# Altium project JlinkV9_RST.PrjPcb
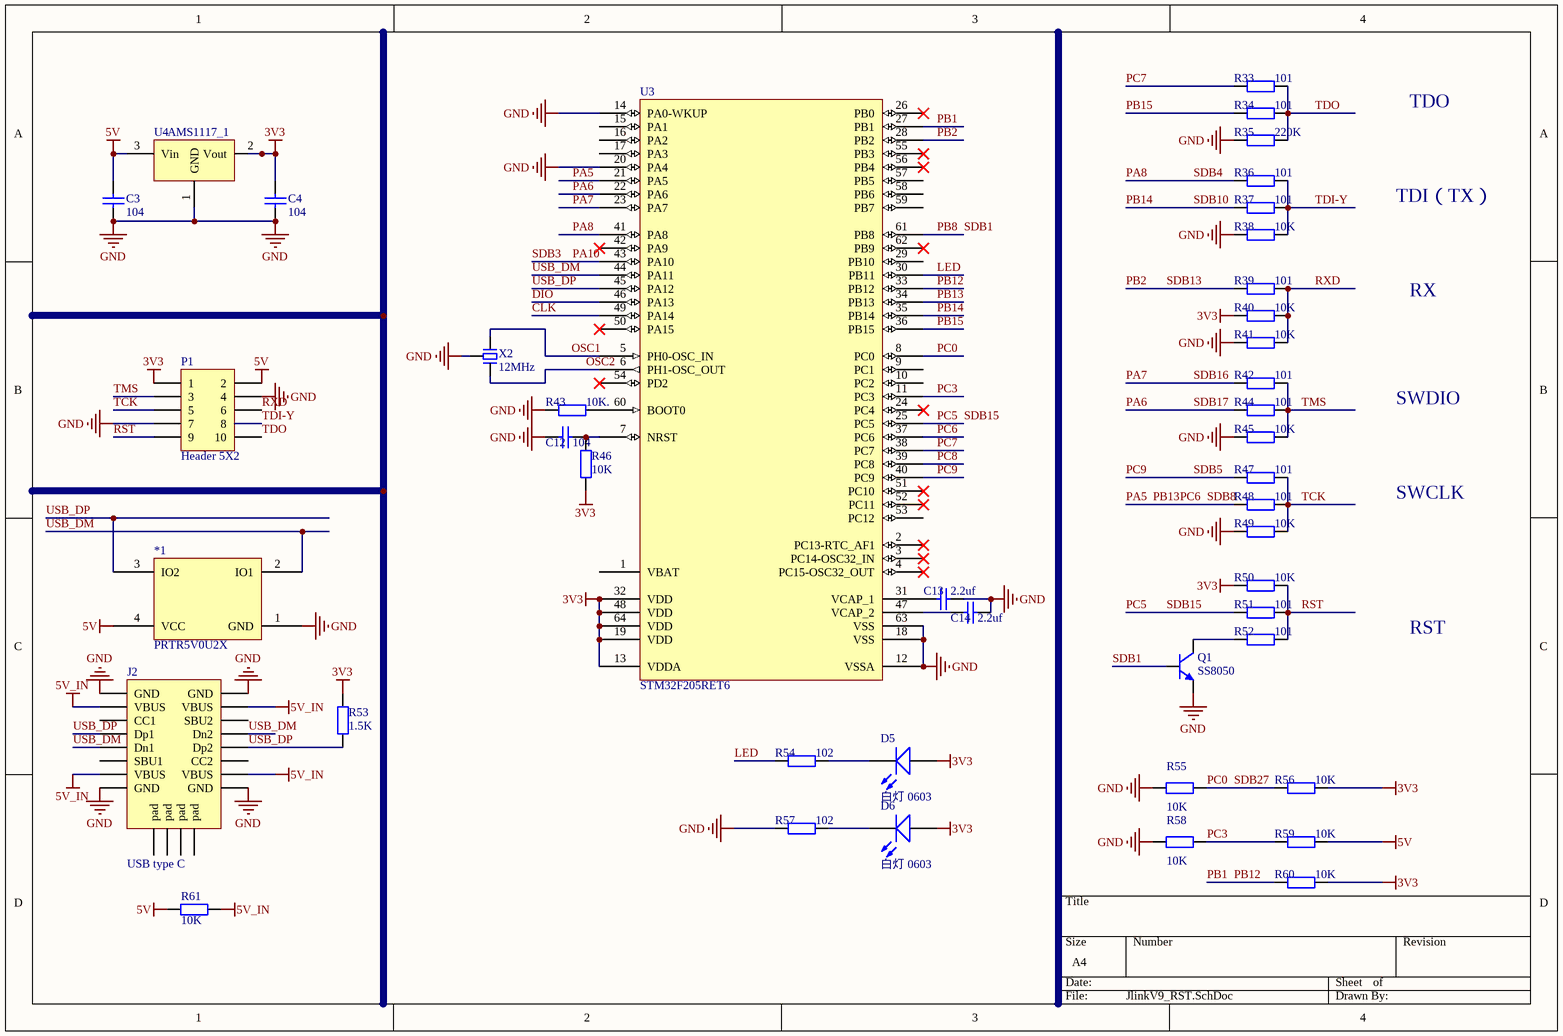
[diagram p0: JlinkV9_RST.SchDoc]
1 sheet, 43 parts. Net scope: global (net labels, ports and power ports of the same name join across sheets).
Board file: JlinkV9_RST.PcbDoc

## Sheet JlinkV9_RST.SchDoc
size A4

### Parts
*1  PRTR5V0U2X  [LC-SOT-143]
C3  104  [LC-0603_C]
C4  104  [LC-0603_C]
C12  104  [LC-0603_C]
C13  2.2UF  [LC-0603_C]
C14  2.2UF  [LC-0603_C]
D5  白灯 0603  [0603_LED_S1]
D6  白灯 0603  [0603_LED_S1]
J2  USB type C  [USB Type-C-16Pin_A]
P1  Header 5X2  [300S-2*5P 2.54MM_2]
Q1  SS8050  [SOT23-3N]
R33  value 101  [LC-0603_R]  (hidden comment: 100R)
R34  value 101  [LC-0603_R]  (hidden comment: 100R)
R35  value 220K  [LC-0603_R]  (hidden comment: 10K)
R36  value 101  [LC-0603_R]  (hidden comment: 100R)
R37  value 101  [LC-0603_R]  (hidden comment: 100R)
R38  10K  [LC-0603_R]
R39  value 101  [LC-0603_R]  (hidden comment: 100R)
R40  10K  [LC-0603_R]
R41  value 10K  [LC-0603_R]  (hidden comment: NC)
R42  value 101  [LC-0603_R]  (hidden comment: 100R)
R43  value 10K.  [LC-0603_R]  (hidden comment: 10K)
R44  value 101  [LC-0603_R]  (hidden comment: 100R)
R45  10K  [LC-0603_R]
R46  10K  [LC-0603_R]
R47  value 101  [LC-0603_R]  (hidden comment: 100R)
R48  value 101  [LC-0603_R]  (hidden comment: 100R)
R49  10K  [LC-0603_R]
R50  value 10K  [LC-0603_R]  (hidden comment: 100R)
R51  value 101  [LC-0603_R]  (hidden comment: 100R)
R52  value 101  [LC-0603_R]  (hidden comment: 100R)
R53  value 1.5K  [LC-0603_R]  (hidden comment: 1K)
R54  value 102  [LC-0603_R]  (hidden comment: 1K)
R55  10K  [LC-0603_R]
R56  10K  [LC-0603_R]
R57  value 102  [LC-0603_R]  (hidden comment: 1K)
R58  10K  [LC-0603_R]
R59  10K  [LC-0603_R]
R60  10K  [LC-0603_R]
R61  value 10K  [LC-0805_R]  (hidden comment: 1A保险丝)
U3  STM32F205RET6  [LQFP64 10x10_N]
U4  AMS1117_1  [LC-SOT-223]
X2  12MHz  [3脚晶振]

### Nets
3V3: C4.2 D5.A D6.A P1.1 R40.1 R46.1 R50.1 R53.1 R56.2 R60.2 U3.13(VDDA) U3.19(VDD) U3.32(VDD) U3.48(VDD) U3.64(VDD) U4.2(Vout)
5V: *1.4(VCC) C3.2 P1.2 R59.2 R61.1 U4.3(Vin)
5V_IN: J2.A4(VBUS) J2.A9(VBUS) J2.B4(VBUS) J2.B9(VBUS) R61.2
GND: *1.1(GND) C3.1 C4.1 C12.2 C13.1 C14.1 J2.A1(GND) J2.A12(GND) J2.B1(GND) J2.B12(GND) P1.4 P1.7 Q1.2(E) R35.1 R38.1 R41.1 R43.1 R45.1 R49.1 R55.1 R57.1 R58.1 U3.12(VSSA) U3.14(PA0-WKUP) U3.18(VSS) U3.20(PA4) U3.63(VSS) U4.1(GND) X2.3
CLK: U3.49(PA14)
DIO: U3.46(PA13)
LED: R54.1 U3.30(PB11)
OSC1: U3.5(PH0-OSC_IN) X2.1
OSC2: U3.6(PH1-OSC_OUT) X2.2
PA5: R48.1 U3.21(PA5) U3.34(PB13) U3.37(PC6)  [also labelled PB13, PC6, SDB8]
PA6: R44.1 U3.22(PA6)  [also labelled SDB17]
PA7: R42.1 U3.23(PA7)  [also labelled SDB16]
PA8: R36.1 U3.41(PA8)  [also labelled SDB4]
PA10: U3.43(PA10)  [also labelled SDB3]
PB1: R60.1 U3.27(PB1) U3.33(PB12)  [also labelled PB12]
PB2: R39.1 U3.28(PB2)  [also labelled SDB13]
PB8: Q1.1(B) U3.61(PB8)  [also labelled SDB1]
PB14: R37.1 U3.35(PB14)  [also labelled SDB10]
PB15: R34.1 U3.36(PB15)
PC0: R55.2 R56.1 U3.8(PC0)  [also labelled SDB27]
PC3: R58.2 R59.1 U3.11(PC3)
PC5: R51.1 U3.25(PC5)  [also labelled SDB15]
PC7: R33.1 U3.38(PC7)
PC8: U3.39(PC8)
PC9: R47.1 U3.40(PC9)  [also labelled SDB5]
RST: P1.9 R50.2 R51.2 R52.2
RXD: P1.6 R39.2 R40.2 R41.2
TCK: P1.5 R47.2 R48.2 R49.2
TDI-Y: P1.8 R36.2 R37.2 R38.2
TDO: P1.10 R33.2 R34.2 R35.2
TMS: P1.3 R42.2 R44.2 R45.2
USB_DM: *1.2(IO1) J2.A7(Dn1) J2.B7(Dn2) U3.44(PA11)
USB_DP: *1.3(IO2) J2.A6(Dp1) J2.B6(Dp2) R53.2 U3.45(PA12)
NetC12_1: C12.1 R46.2 U3.7(NRST)
NetC13_2: C13.2 U3.31(VCAP_1)
NetC14_2: C14.2 U3.47(VCAP_2)
NetD5_K: D5.K R54.2
NetD6_K: D6.K R57.2
NetQ1_3: Q1.3(C) R52.1
NetR43_2: R43.2 U3.60(BOOT0)

Not connected (* = marked no-connect by the designer): J2 0(pad) A5(CC1) A8(SBU1) B5(CC2) B8(SBU2); U3 1(VBAT) 2(PC13-RTC_AF1)* 3(PC14-OSC32_IN)* 4(PC15-OSC32_OUT)* 9(PC1) 10(PC2) 15(PA1) 16(PA2) 17(PA3) 24(PC4)* 26(PB0)* 29(PB10) 42(PA9)* 50(PA15)* 51(PC10)* 52(PC11)* 53(PC12) 54(PD2)* 55(PB3)* 56(PB4)* 57(PB5) 58(PB6) 59(PB7) 62(PB9)*

### Notes on the sheet
- TDO
- TDI（TX）
- RX
- SWDIO
- SWCLK
- RST

### Library data of the parts
C3 C4 C12-C14 = Cap: Polarized Capacitor (Radial); Published: 8-Jun-2000; Revision: July-2002: Re-released for DXP Platform.; Publisher: Altium Limited
  C3 C4 C12: Value: 104
  C13 C14: Value: 2.2uf
D5 D6 = 0603 白灯: 发光二极管; ComponentLink1Description: 供应商链接; ComponentLink1URL: http://www.szlcsc.com/product/details_2663.html; Package: 0603; Supplier: LC; SuppliersPartNumber: C2290
J2 = USB_C
P1 = Header 5X2: Header, 5-Pin, Dual row; LatestRevisionDate: 17-Jul-2002; LatestRevisionNote: Re-released for DXP Platform.; Publisher: Altium Limited
Q1 = 8050-SMD: 高频放大-NPN型; 版权归属: 源创客; 属性: 40V 1.5A 1W 100MHZ; BOM名称: 高频放大-NPN型; 学习资源: www.ooocke.com
R33-R52 R54-R60 = Resistor: Resistor Chip; Published: 8-Jun-2000; Revision: July-2002: Re-released for DXP Platform.; Publisher: Altium Limited
  R38 R40 R45 R46 R49 R55 R56 R58-R60: Value: 10K
R53 R61 = Res2: Resistor; Published: 8-Jun-2000; LatestRevisionDate: 17-Jul-2002; LatestRevisionNote: Re-released for DXP Platform.; PackageReference: AXIAL-0.4; Publisher: Altium Limited
U3 = STM32F205RET6: Microcontroller   ST; Code: 104261; Vision: V5.0; Value: STM32F205RET6; LatestRevisionDate: 25-Mar-2015; PackageReference: SQFP10x10-64; Brand: ST; InitialReleaseDate: 25-Mar-2015
U4 = AMS1117_1: 3.3V电压转换器AMS1117
X2 = XTAL-3P: 3脚无源晶振; BOM名称: 2脚晶振; 版权归属: 源创客; 学习资源: www.ooocke.com